# Altium schematic sheet Dot_matrix.SchDoc
size A4
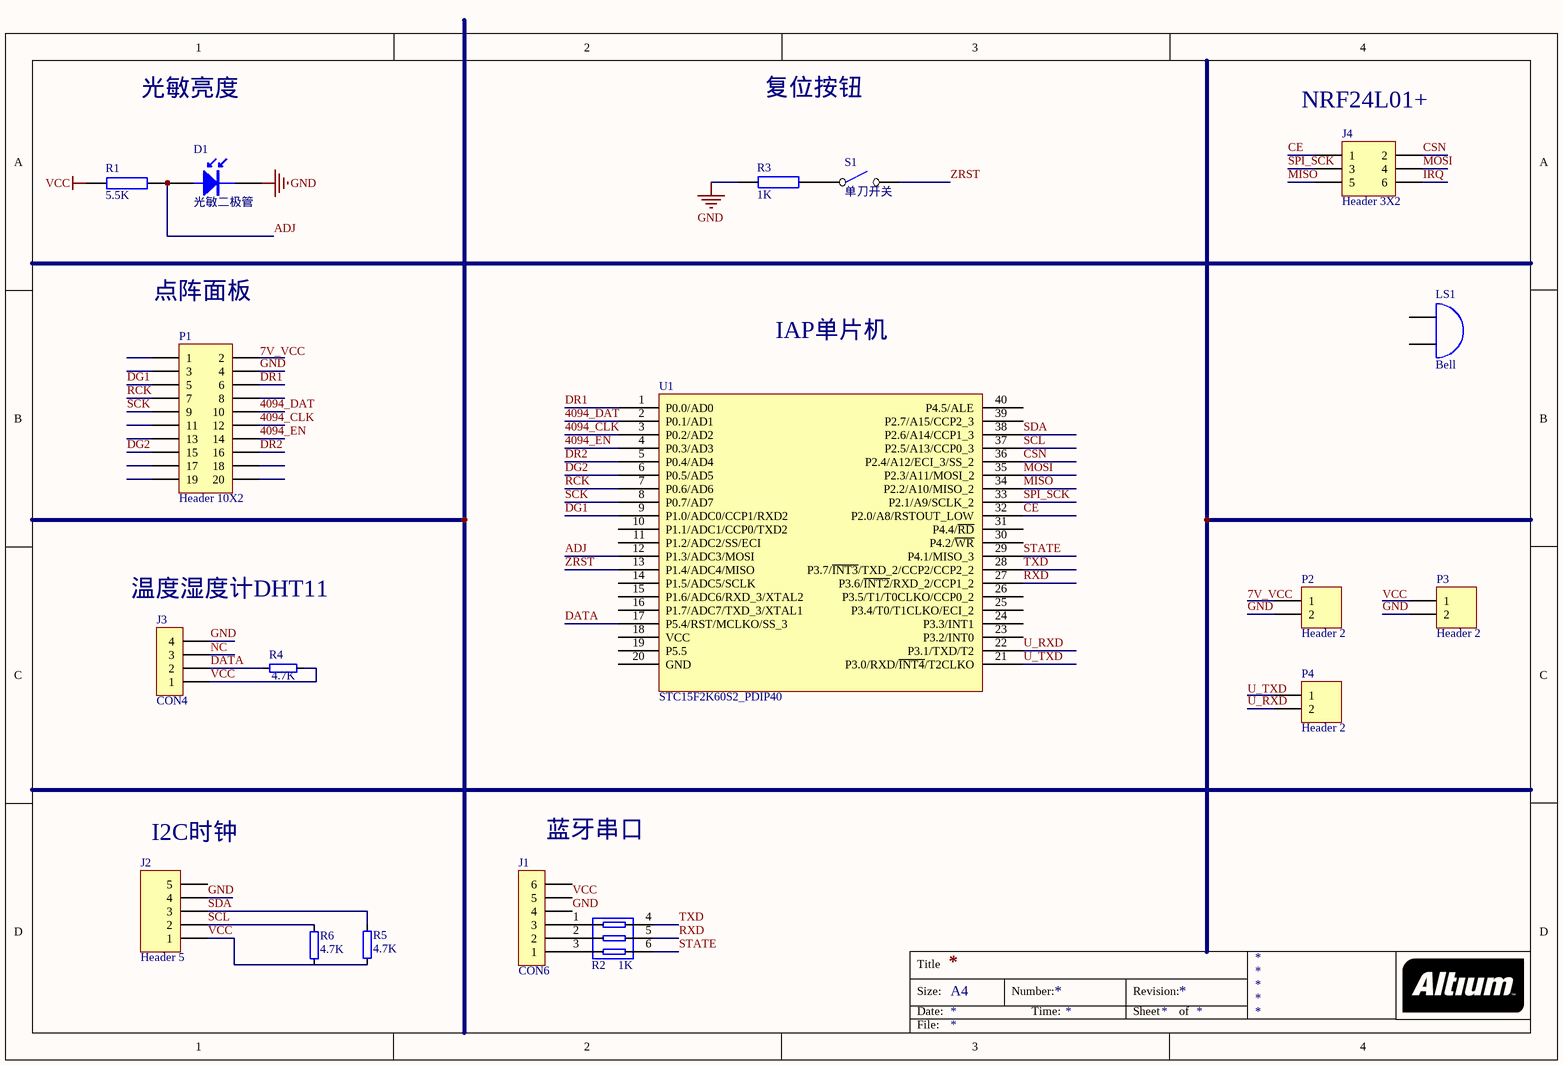
[diagram p0: Dot_matrix.SchDoc]

## Parts
D1  光敏二极管
J1  CON6  [DG1286]
J2  Header 5  [HDR1X5]
J3  CON4
J4  Header 3X2  [HDR2X3]
LS1  Bell  [PIN2]
P1  Header 10X2  [HDR2X10]
P2  Header 2  [HDR1X2]
P3  Header 2  [HDR1X2]
P4  Header 2  [HDR1X2]
R1  5.5K  [0805R]
R2  1K
R3  1K  [0805R]
R4  4.7K  [AXIAL0.3]
R5  4.7K  [AXIAL0.3]
R6  4.7K  [AXIAL0.3]
S1  单刀开关
U1  STC15F2K60S2_PDIP40  [DIP40]

## Nets
GND: D1.2(K) J1.4 J2.4 J3.4 P1.4 P2.2 P3.2 R3.1
VCC: J1.5 J2.1 J3.1 R1.1 R4.1 R5.1 R6.1
4094_CLK: P1.12 U1.3(P0.2/AD2)
4094_DAT: P1.10 U1.2(P0.1/AD1)
4094_EN: P1.14 U1.4(P0.3/AD3)
ADJ: D1.1(A) R1.2 U1.12(P1.3/ADC3/MOSI)
CE: J4.1 U1.32(P2.0/A8/RSTOUT_LOW)
CSN: J4.2 U1.36(P2.4/A12/ECI_3/SS_2)
DATA: J3.2 R4.2 U1.17(P5.4/RST/MCLKO/SS_3)
DG1: P1.5 U1.9(P1.0/ADC0/CCP1/RXD2)
DG2: P1.15 U1.6(P0.5/AD5)
DR1: P1.6 U1.1(P0.0/AD0)
DR2: P1.16 U1.5(P0.4/AD4)
IRQ: J4.6
MISO: J4.5 U1.34(P2.2/A10/MISO_2)
MOSI: J4.4 U1.35(P2.3/A11/MOSI_2)
RCK: P1.7 U1.7(P0.6/AD6)
RXD: R2.5 U1.27(P3.6/~{INT2}/RXD_2/CCP1_2)
SCK: P1.9 U1.8(P0.7/AD7)
SCL: J2.2 R6.2 U1.37(P2.5/A13/CCP0_3)
SDA: J2.3 R5.2 U1.38(P2.6/A14/CCP1_3)
SPI_SCK: J4.3 U1.33(P2.1/A9/SCLK_2)
STATE: R2.6 U1.29(P4.1/MISO_3)
TXD: R2.4 U1.28(P3.7/~{INT3}/TXD_2/CCP2/CCP2_2)
U_RXD: P4.2 U1.22(P3.1/TXD/T2)
U_TXD: U1.21(P3.0/RXD/~{INT4}/T2CLKO)
ZRST: S1.2 U1.13(P1.4/ADC4/MISO)
NetJ1_1: J1.1 R2.3
NetJ1_2: J1.2 R2.2
NetJ1_3: J1.3 R2.1
NetR3_2: R3.2 S1.1

Not connected (* = marked no-connect by the designer): J1 6; J2 5; J3 3; LS1 1(A) 2(B); P1 1 2 3 8 11 13 17 18 19 20; P2 1; P3 1; P4 1; U1 10(P1.1/ADC1/CCP0/TXD2) 11(P1.2/ADC2/SS/ECI) 14(P1.5/ADC5/SCLK) 15(P1.6/ADC6/RXD_3/XTAL2) 16(P1.7/ADC7/TXD_3/XTAL1) 18(VCC) 19(P5.5) 20(GND) 23(P3.2/INT0) 24(P3.3/INT1) 25(P3.4/T0/T1CLKO/ECI_2) 26(P3.5/T1/T0CLKO/CCP0_2) 30(P4.2/~{WR}) 31(P4.4/~{RD}) 39(P2.7/A15/CCP2_3) 40(P4.5/ALE)

## Notes on the sheet
- 光敏亮度
- 复位按钮
- (near J4) NRF24L01+
- (near P1) 点阵面板
- IAP单片机
- (near J3) 温度湿度计DHT11
- (near J3) NC
- (near J2) I2C时钟
- (near J1) 蓝牙串口
- Labels drawn without touching a wire or pin: 7V_VCC, U_TXD, VCC
- Title
- Size:
- Date:
- A4
- Number:
- Time:
- Revision:
- Sheet
- of
- File:

## Library data of the parts
D1 = 光敏二极管: Photosensitive Diode
J1 = CON6: Connector
J2 = Header 5: Header, 5-Pin; LatestRevisionDate: 17-Jul-2002; LatestRevisionNote: Re-released for DXP Platform.; Publisher: Altium Limited
J3 = CON4: Connector
J4 = Header 3X2: Header, 3-Pin, Dual row; LatestRevisionDate: 17-Jul-2002; LatestRevisionNote: Re-released for DXP Platform.; Publisher: Altium Limited
LS1 = Bell: Electrical Bell; Published: 24-Mar-1999; LatestRevisionDate: 17-Jul-2002; LatestRevisionNote: Re-released for DXP Platform.; PackageReference: PIN2; Publisher: Altium Limited
P1 = Header 10X2: Header, 10-Pin, Dual row; LatestRevisionDate: 17-Jul-2002; LatestRevisionNote: Re-released for DXP Platform.; Publisher: Altium Limited
P2-P4 = Header 2: Header, 2-Pin; LatestRevisionDate: 17-Jul-2002; LatestRevisionNote: Re-released for DXP Platform.; Publisher: Altium Limited
R1 R3 = RES2
R2 = RES3
R4-R6 = RES